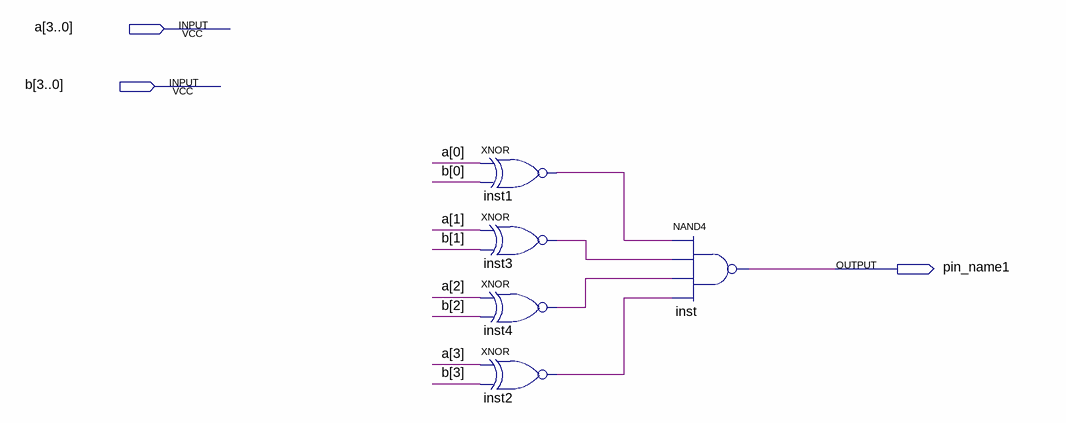
[diagram p0: schematic sheet]
// Quartus schematic comp_igual.bdf as structural Verilog: 5 symbols, 3 pins
module comp_igual (
  input  [3:0] a,
  input  [3:0] b,
  output pin_name1
);

  wire inst1_out, inst2_out, inst3_out, inst4_out;

  xnor inst1 (inst1_out, a[0], b[0]);
  xnor inst3 (inst3_out, a[1], b[1]);
  xnor inst4 (inst4_out, a[2], b[2]);
  xnor inst2 (inst2_out, a[3], b[3]);
  nand inst (pin_name1, inst1_out, inst3_out, inst4_out, inst2_out);
endmodule
